# Altium schematic sheet Sheet_1.schdoc
size 405 x 194 mm
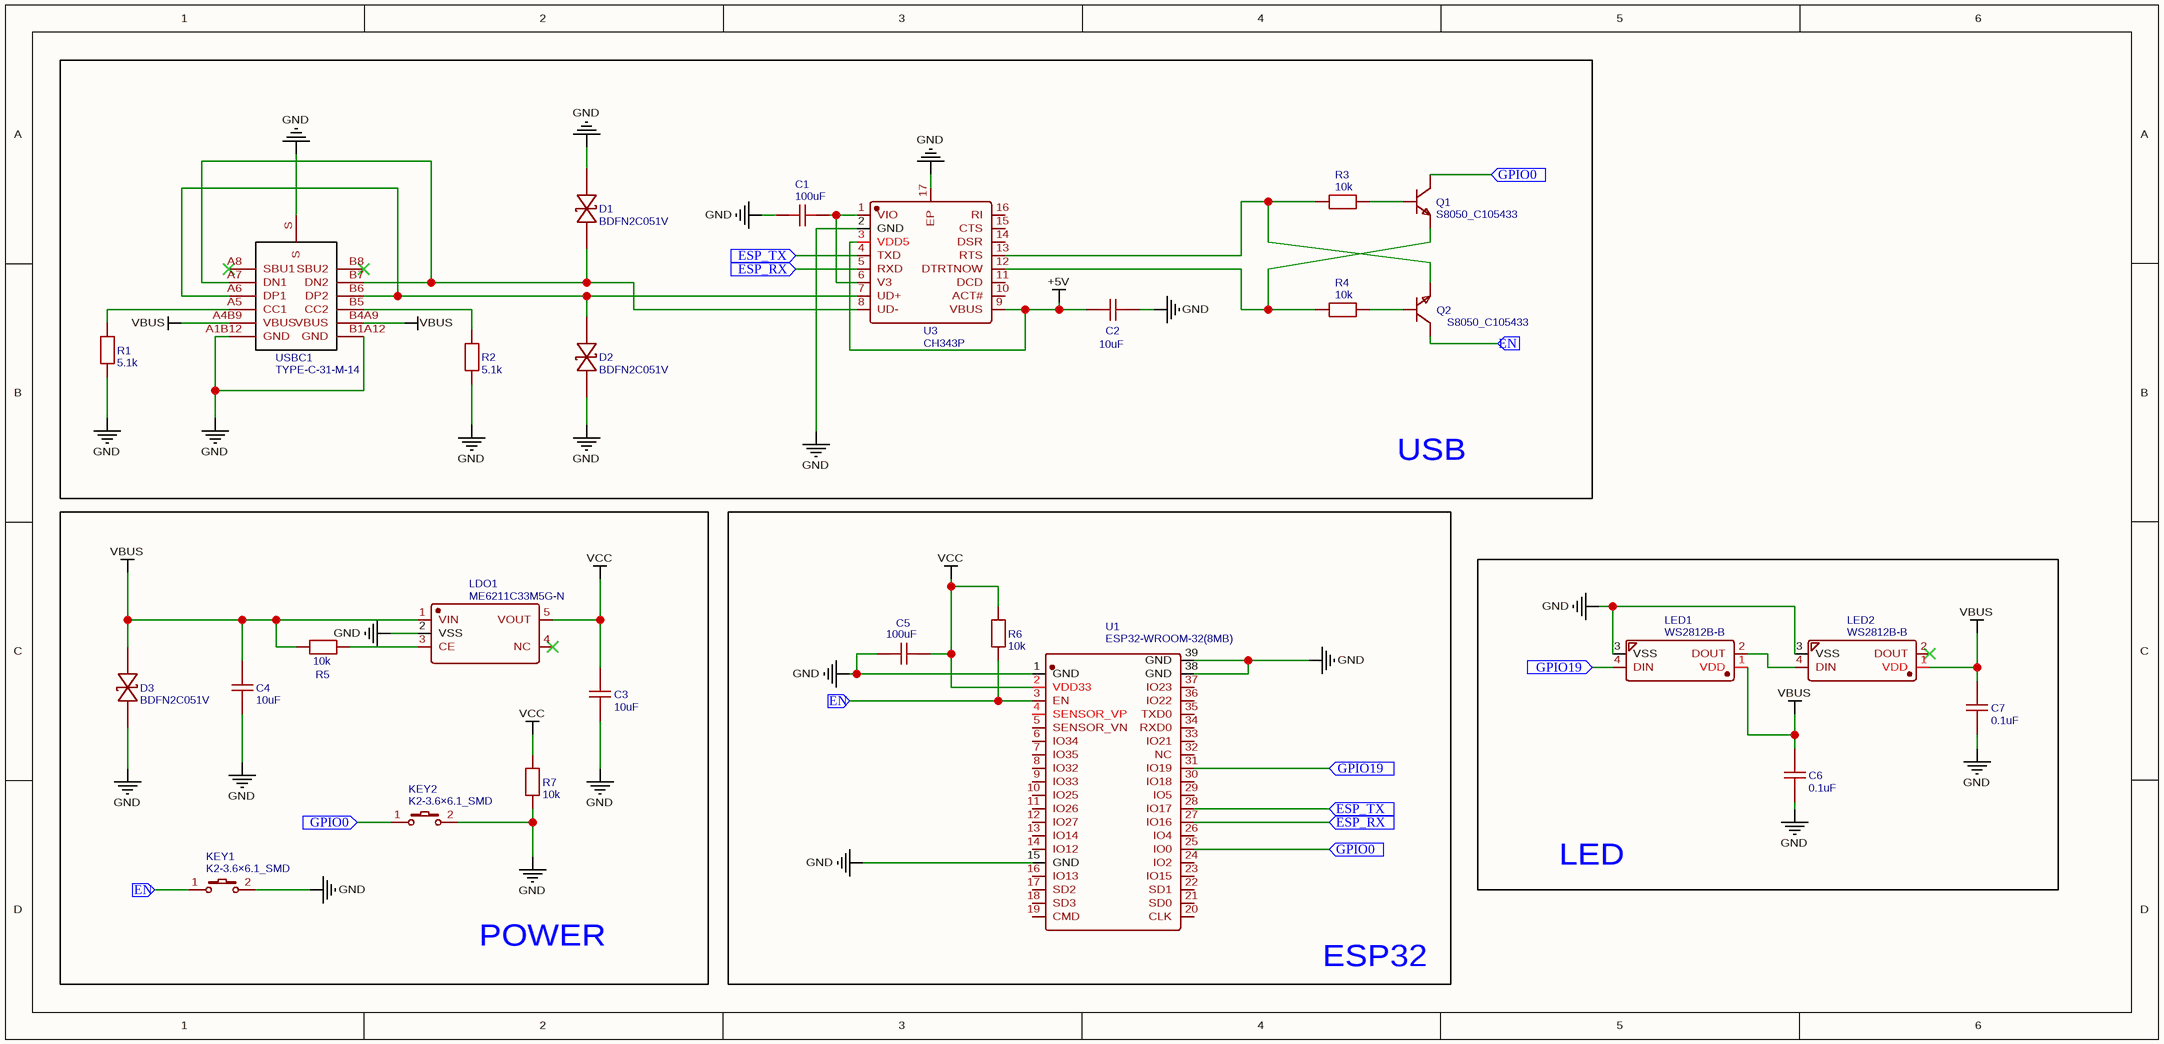
[diagram p0: Sheet_1.schdoc]

## Parts
C1  100uF  [C0603]
C2  10uF  [C0603]
C3  10uF  [C0603]
C4  10uF  [C0603]
C5  100uF  [C0603]
C6  0.1uF  [C0603]
C7  0.1uF  [C0603]
D1  BDFN2C051V  [X1SON-2_L1.0-W0.6-P0.65-BI]
D2  BDFN2C051V  [X1SON-2_L1.0-W0.6-P0.65-BI]
D3  BDFN2C051V  [X1SON-2_L1.0-W0.6-P0.65-BI]
KEY1  K2-3.6×6.1_SMD  [KEY-SMD_2P-L6.2-W3.6-LS8.0]
KEY2  K2-3.6×6.1_SMD  [KEY-SMD_2P-L6.2-W3.6-LS8.0]
LDO1  ME6211C33M5G-N  [SOT-23-5_L3.0-W1.7-P0.95-LS2.8-BL]
LED1  WS2812B-B  [LED-SMD_4P-L5.0-W5.0-BL_TC5050RGB]
LED2  WS2812B-B  [LED-SMD_4P-L5.0-W5.0-BL_TC5050RGB]
Q1  S8050_C105433  [SOT-23-3_L2.9-W1.6-P1.90-LS2.8-BR]
Q2  S8050_C105433  [SOT-23-3_L2.9-W1.6-P1.90-LS2.8-BR]
R1  5.1k  [R0603]
R2  5.1k  [R0603]
R3  10k  [R0603]
R4  10k  [R0603]
R5  10k  [R0603]
R6  10k  [R0603]
R7  10k  [R0603]
U1  ESP32-WROOM-32(8MB)  [WIFIM-SMD_39P-L25.5-W18.0-P1.27]
U3  CH343P  [TQFN-16_L3.0-W3.0-P0.50-BL-EP1.7]
USBC1  TYPE-C-31-M-14  [USB-C-SMD_12P-P0.50-H-F_TYPE-C-31-M-14]

## Blocks framed on the sheet
USB: C1 C2 D1 D2 Q1 Q2 R1-R4 U3 USBC1
POWER: C3 C4 D3 KEY1 KEY2 LDO1 R5 R7
ESP32: C5 R6 U1
LED: C6 C7 LED1 LED2

## Ports
EN (in), ESP_RX (in), ESP_TX (in), GPIO0 (in), GPIO19 (in)

## Nets
+5V: C2.1 U3.3(VDD5) U3.9(VBUS)
GND: C1.1 C2.2 C3.1 C4.1 C5.1 C6.2 C7.2 D1.1 D2.2 D3.2 KEY1.2 KEY2.2 LDO1.2(VSS) LED1.3(VSS) LED2.3(VSS) R1.2 R2.2 R7.1 U1.1(GND) U1.15(GND) U1.38(GND) U1.39(GND) U3.2(GND) U3.17(EP) USBC1.A1B12(GND) USBC1.B1A12(GND) USBC1.S
VBUS: C4.2 C6.1 C7.1 D3.1 LDO1.1(VIN) LED1.1(VDD) LED2.1(VDD) R5.1 USBC1.A4B9(VBUS) USBC1.B4A9(VBUS)
VCC: C3.2 C5.2 LDO1.5(VOUT) R6.2 R7.2 U1.2(VDD33)
EN: KEY1.1 Q2.3 R6.1 U1.3(EN) ; port EN
ESP_RX: U1.27(IO16) U3.5(RXD) ; port ESP_RX
ESP_TX: U1.28(IO17) U3.4(TXD) ; port ESP_TX
GPIO0: KEY2.1 Q1.3 U1.25(IO0) ; port GPIO0
GPIO19: LED1.4(DIN) U1.31(IO19) ; port GPIO19
NetC1_2: C1.2 U3.1(VIO) U3.6(V3)
NetD1_2: D1.2 U3.8(UD-) USBC1.A7(DN1) USBC1.B7(DN2)
NetD2_1: D2.1 U3.7(UD+) USBC1.A6(DP1) USBC1.B6(DP2)
NetLDO1_3: LDO1.3(CE) R5.2
NetLED1_2: LED1.2(DOUT) LED2.4(DIN)
NetQ1_1: Q1.1 R3.2
NetQ1_2: Q1.2 R4.1 U3.12(DTRTNOW)
NetQ2_1: Q2.1 R4.2
NetQ2_2: Q2.2 R3.1 U3.13(RTS)
NetR1_1: R1.1 USBC1.A5(CC1)
NetR2_1: R2.1 USBC1.B5(CC2)

Not connected (* = marked no-connect by the designer): LDO1 4(NC)*; LED2 2(DOUT)*; U1 4(SENSOR_VP) 5(SENSOR_VN) 6(IO34) 7(IO35) 8(IO32) 9(IO33) 10(IO25) 11(IO26) 12(IO27) 13(IO14) 14(IO12) 16(IO13) 17(SD2) 18(SD3) 19(CMD) 20(CLK) 21(SD0) 22(SD1) 23(IO15) 24(IO2) 26(IO4) 29(IO5) 30(IO18) 32(NC) 33(IO21) 34(RXD0) 35(TXD0) 36(IO22) 37(IO23); U3 10(ACT#) 11(DCD) 14(DSR) 15(CTS) 16(RI); USBC1 A8(SBU1)* B8(SBU2)*

## Library data of the parts
C1 C5 = 100uF: nameAlias: Value(F); Contributor: LCEDA_Lib; spicePre: C; spiceSymbolName: C_0603_US
C2-C4 = 10uF: nameAlias: Value(F); Contributor: LCEDA_Lib; spicePre: C; spiceSymbolName: C_0603_US
C6 C7 = 0.1uF: nameAlias: Value(F); Contributor: LCEDA_Lib; spicePre: C; spiceSymbolName: C_0603_US
D1-D3 = BDFN2C051V: BOM_Manufacturer: BORN(伯恩半导体); Contributor: LCSC; BOM_Supplier: LCSC; BOM_Supplier Part: C152024; BOM_Manufacturer Part: BDFN2C051V; BOM_JLCPCB Part Class: Extended Part; spicePre: D; spiceSymbolName: BDFN2C051V
KEY1 KEY2 = K2-3.6×6.1_SMD: BOM_Manufacturer Part: K2-1107ST-A4SW-06; Contributor: LCEDA_Lib; 制造商: 韩国韩荣; BOM_Supplier Part: C118141; BOM_Supplier: LCSC; spicePre: K; spiceSymbolName: K2-3.6×6.1_SMD
LDO1 = ME6211C33M5G-N: BOM_Manufacturer: MICRONE(南京微盟); BOM_Supplier: LCSC; BOM_Manufacturer Part: ME6211C33M5G-N; BOM_Supplier Part: C82942; BOM_JLCPCB Part Class: Extended Part; spicePre: L; spiceSymbolName: ME6211C33M5G-N
LED1 LED2 = WS2812B-B: BOM_Manufacturer: worldsemi; Contributor: LCSC; BOM_Supplier: LCSC; BOM_Manufacturer Part: WS2812B-B; BOM_Supplier Part: C114586; BOM_JLCPCB Part Class: Extended Part; spicePre: L; spiceSymbolName: WS2812B-B
Q1 Q2 = S8050_C105433: BOM_Manufacturer: CJ(江苏长电/长晶); BOM_Manufacturer Part: S8050; BOM_Supplier: LCSC; BOM_Supplier Part: C105433; BOM_JLCPCB Part Class: Extended Part; spicePre: Q; spiceSymbolName: S8050_C105433
R1 R2 = 5.1k: nameAlias: Value(Ω); Contributor: LCEDA_Lib; spicePre: R; spiceSymbolName: R_0603_EU
R3-R7 = 10k: nameAlias: Value(Ω); Contributor: LCEDA_Lib; spicePre: R; spiceSymbolName: R_0603_EU
U1 = ESP32-WROOM-32(8MB): BOM_Manufacturer: ESPRESSIF(乐鑫); BOM_Manufacturer Part: ESP32-WROOM-32-N8; Contributor: LCSC; BOM_Supplier: LCSC; BOM_Supplier Part: C529582; BOM_JLCPCB Part Class: Extended Part; spicePre: U; spiceSymbolName: ESP32-WROOM-32(8MB)
U3 = CH343P: BOM_Manufacturer: WCH(南京沁恒); Contributor: LCSC; BOM_Supplier: LCSC; BOM_Supplier Part: C2846043; BOM_Manufacturer Part: CH343P; BOM_JLCPCB Part Class: Extended Part; spicePre: U; spiceSymbolName: CH343P
USBC1 = TYPE-C-31-M-14: BOM_Manufacturer: 韩国韩荣; Contributor: LCSC; BOM_Supplier: LCSC; BOM_Supplier Part: C223907; BOM_Manufacturer Part: TYPE-C-31-M-14; BOM_JLCPCB Part Class: Extended Part; spicePre: U; spiceSymbolName: TYPE-C-31-M-14